# EAGLE design micICS40310 (EAGLE 9.2.2)
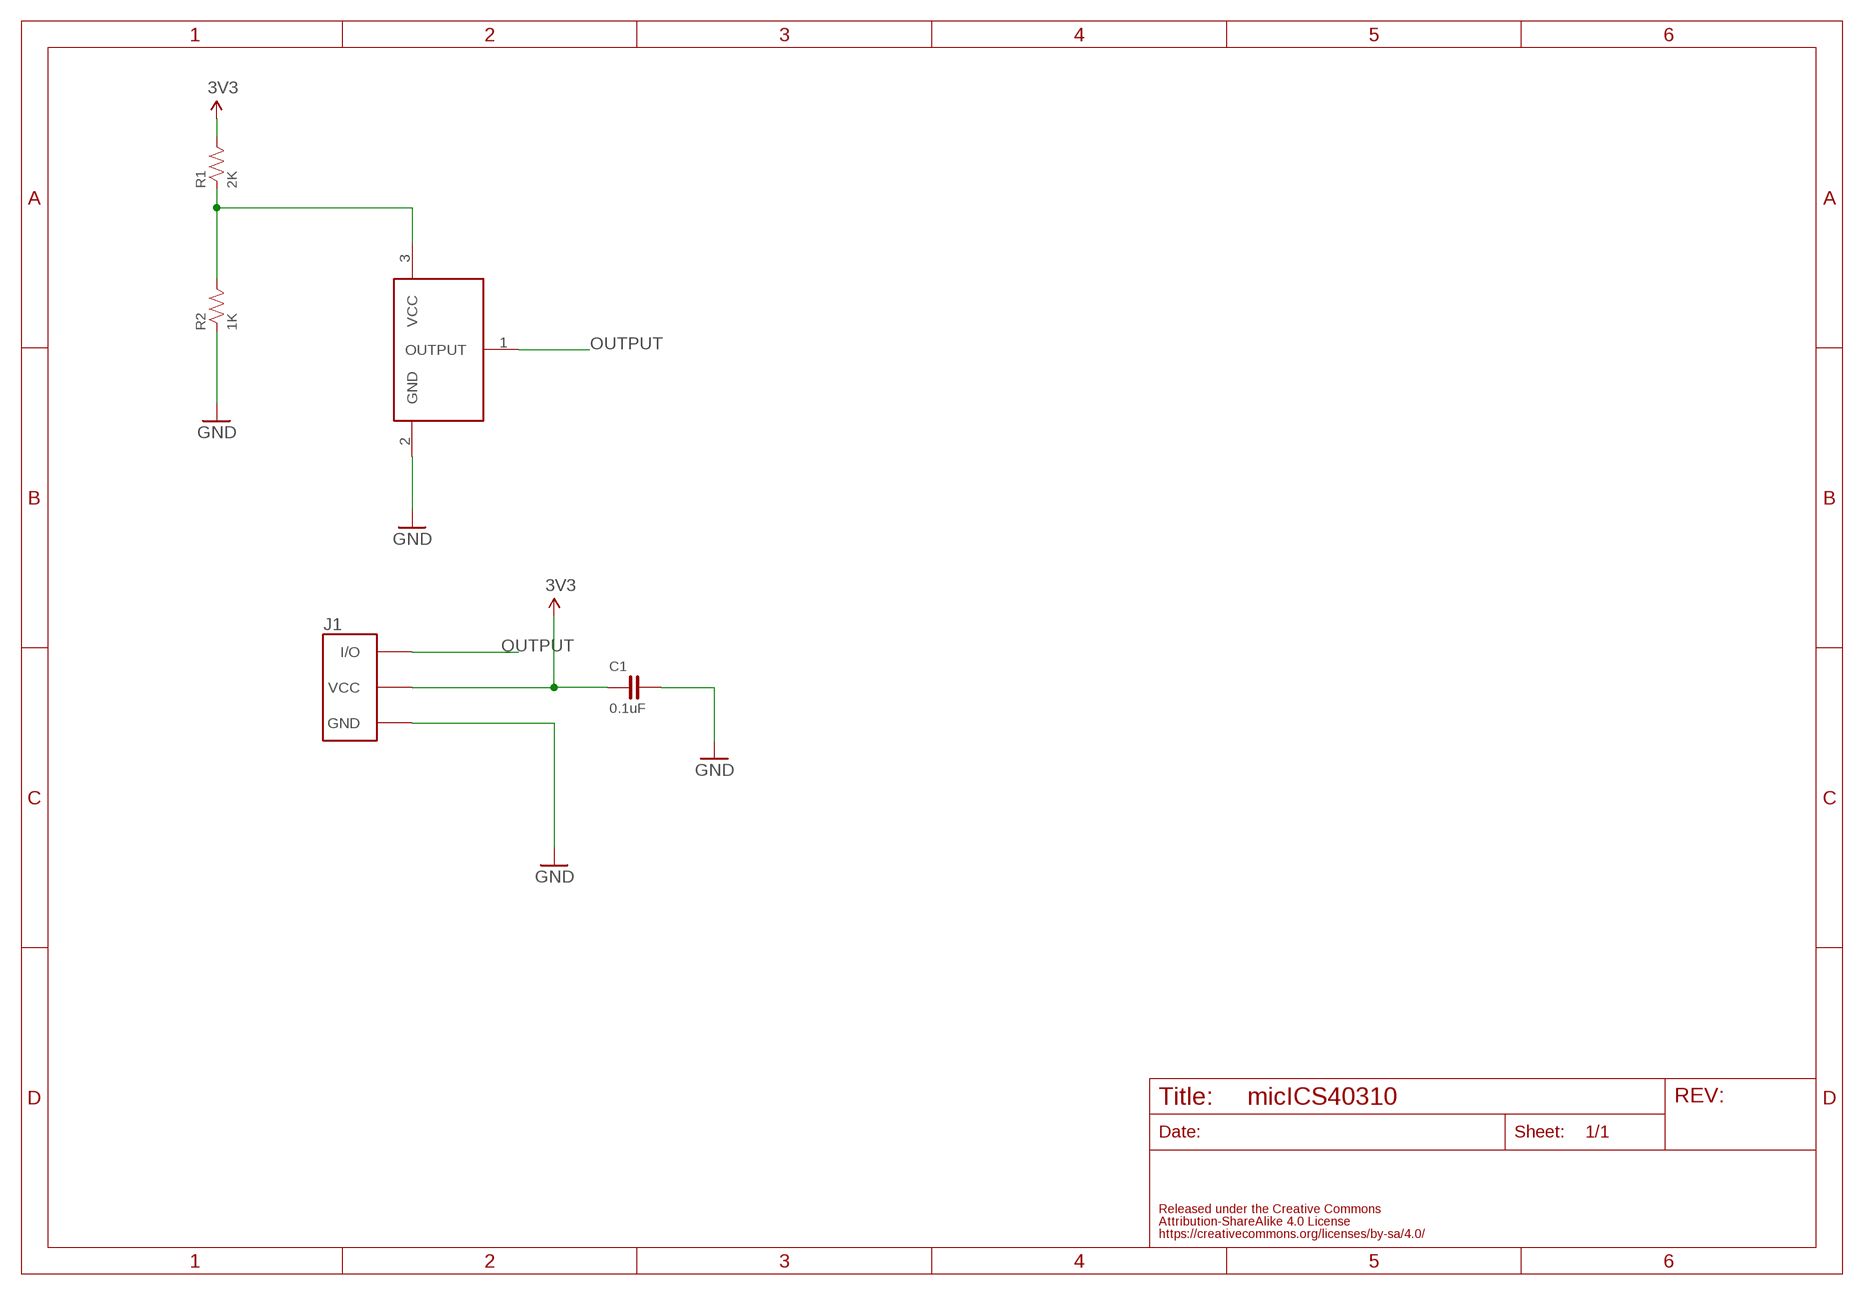
[diagram p0: schematic, sheet 1]

## Parts
C1  0.1uF  CAPACITOR-0603  [0603]
ICS40310  ANALOG-MICICS40310  [ICS40310]
J1  FABO_BRICK_3PIN-03B-PASK-1_NAME_BOTTOM  [FABO_BRICK_3PIN_B03B-PASK-1_NAME_BOTTOM]
R1  2K  RESISTOR-0603  [0603]
R2  1K  RESISTOR-0603  [0603]

## Nets
3V3: C1.1 J1.VCC R1.2
GND: C1.2 ICS40310.2(GND) J1.GND R2.1
N$1: ICS40310.3(VCC) R1.1 R2.2
OUTPUT: ICS40310.1(OUTPUT) J1.I/O

## Library data of the parts
C1 = FaBo-Capacitor:CAPACITOR: CAPACITOR
ICS40310 = FaBo-Sound:ANALOG-MIC
J1 = FaBo-Template:FABO_BRICK_3PIN: FaBo Brick 3pin
R1 R2 = FaBo-Resistors:RESISTOR: RESISTOR

## Board
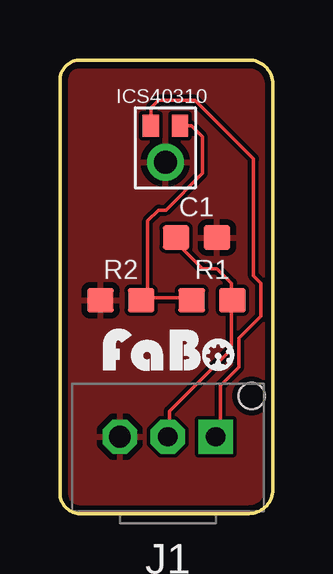
[diagram p1: board, top side]
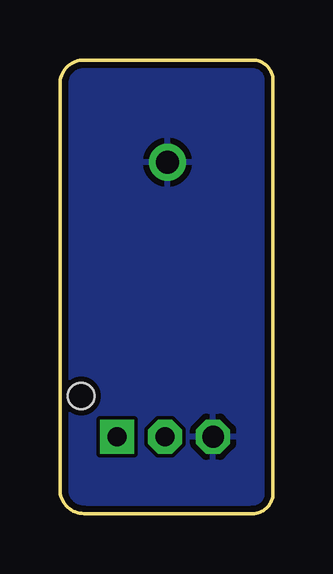
[diagram p2: board, bottom side, seen from below]

Size 8.89 x 18.9 mm. Coordinates in mm from the lower left corner, seen from the top.
Outline: 0,0.85 0,18.05 arc-90 0.85,18.9 7.88,18.9 arc-90 8.89,17.89 8.89,1.01 arc-90 7.88,0 0.85,0 arc-90 0,0.85
Copper layers (1*16): Top 0.035mm / dielectric 1.5mm / Bottom 0.035mm
Design rules "SeeedStudio_2layer_DRU_no_angle_20140221": minimum track width 6mil, minimum drill 12mil, track to track 6mil, track to pad 6mil, pad to pad 6mil, via to via 6mil, smd to smd 0mil, copper to edge 10mil, drill to drill 10mil, minimum pad ring 10mil, minimum via ring 6mil, stop-mask expansion 2mil, vias tented up to drill 100mil, thermal gap 10mil

### Footprints (pad centres in the part's own frame; a part is rotated, then mirrored left to right if it is on the bottom)
0603 = smd 1.1 x 1: 1 -0.85,0; 2 0.85,0
ICS40310 = smd 0.68 x 0.9: 1 -0.61,0.92; 3 0.61,0.92 | drill 0.95 pad 1.55: 2 0,-0.6
FABO_BRICK_3PIN_B03B-PASK-1_NAME_BOTTOM = drill 0.9 pad 1.422 octagon: GND -2,0 | drill 0.8 pad 1.422 square: I/O 2,0 | drill 0.8 pad 1.422 octagon: VCC 0,0 | hole 1.1: 3.5,1.7

### Placement (x,y rotation side)
C1  5.7,11.5 0 top
ICS40310  4.4,15.24 0 top
J1  4.5,3.2 0 top
R1  6.35,8.89 0 top
R2  2.54,8.89 0 top
U$2  [LOGO_FABO_S]  4.6,5.8 0 top

### Tracks (layer width: path | path; a pad name or v marks a point on that pad's centre or on a via)
3V3
  Top 0.152: C1.1 4.72,11.43 5.94,10.21 6.55,10.21 7.16,9.6 7.16,8.99 R1.2 7.16,8.84 7.16,6.86 4.57,4.27 4.57,3.2 J1.VCC
GND
  pour Bottom: 0,0 0,19.05 8.89,19.05 8.89,0
  pour Top: 0,0 0,19.05 8.89,19.05 8.89,0
N$1
  Top 0.152: 3.5,8.99 3.66,9.14 3.66,12.19 4.12,12.65 4.42,12.65 5.94,14.17 5.94,15.7 5.49,16.15 5.03,16.15 ICS40310.3 | 3.5,8.99 5.49,8.99 R1.1 | 3.5,8.99 R2.2
OUTPUT
  Top 0.152: ICS40310.1 3.81,16.31 3.81,16.92 4.12,17.22 5.64,17.22 8.08,14.78 8.08,9.91 8.38,9.6 8.38,8.23 7.47,7.32 7.47,6.1 6.71,5.33 6.71,3.35 6.55,3.2 J1.I/O